# EAGLE design design (EAGLE 9.0.0)
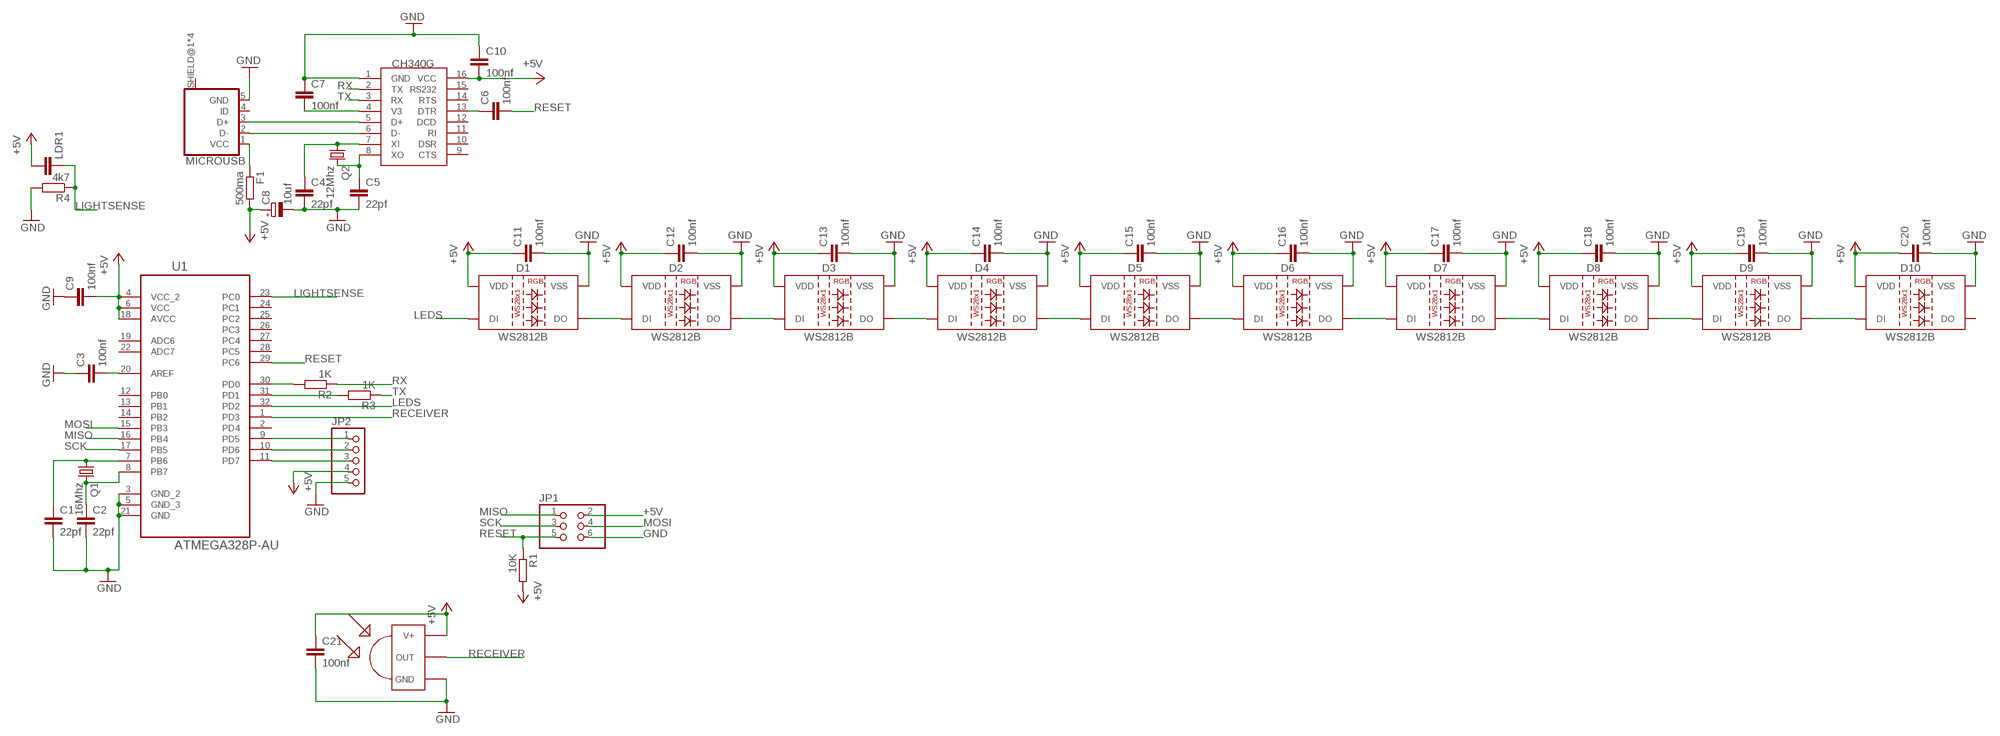
[diagram p0: schematic, sheet 1]

## Parts
C1  22pf  C-EUC0603  [C0603]
C2  22pf  C-EUC0603  [C0603]
C3  100nf  C-EUC0603  [C0603]
C4  22pf  C-EUC0603  [C0603]
C5  22pf  C-EUC0603  [C0603]
C6  100nf  C-EUC0603  [C0603]
C7  100nf  C-EUC0603  [C0603]
C8  10uf  CPOL-EUC  [PANASONIC_C]
C9  100nf  C-EUC0603  [C0603]
C10  100nf  C-EUC0603  [C0603]
C11  100nf  C-EUC0603  [C0603]
C12  100nf  C-EUC0603  [C0603]
C13  100nf  C-EUC0603  [C0603]
C14  100nf  C-EUC0603  [C0603]
C15  100nf  C-EUC0603  [C0603]
C16  100nf  C-EUC0603  [C0603]
C17  100nf  C-EUC0603  [C0603]
C18  100nf  C-EUC0603  [C0603]
C19  100nf  C-EUC0603  [C0603]
C20  100nf  C-EUC0603  [C0603]
C21  100nf  C-EUC0603  [C0603]
D1  WS2812B  [WS2812B]
D2  WS2812B  [WS2812B]
D3  WS2812B  [WS2812B]
D4  WS2812B  [WS2812B]
D5  WS2812B  [WS2812B]
D6  WS2812B  [WS2812B]
D7  WS2812B  [WS2812B]
D8  WS2812B  [WS2812B]
D9  WS2812B  [WS2812B]
D10  WS2812B  [WS2812B]
F1  500ma  R-EU_R1206  [R1206]
JP1  PINHD-2X3  [2X03]
JP2  PINHD-1X5  [1X05]
LDR1  C-EU025-030X050  [C025-030X050]
MICROUSB  MICROUSB  [MICROSUSB]
Q1  16Mhz  CRYSTALHC49S  [HC49/S]
Q2  12Mhz  CRYSTALHC49S  [HC49/S]
R1  10K  R-EU_R0603  [R0603]
R2  1K  R-EU_R0603  [R0603]
R3  1K  R-EU_R0603  [R0603]
R4  4k7  R-EU_R0603  [R0603]
U1  ATMEGA328P-AU  [QFP80P900X900X120-32N]
U2  CH340G  [SOIC16]
U$3  TSOP1838  [TSOP18XX]

## Nets
+5V: C8.+ C9.2 C10.2 C11.1 C12.1 C13.1 C14.1 C15.1 C16.1 C17.1 C18.1 C19.1 C20.1 C21.1 D1.1(VDD) D2.1(VDD) D3.1(VDD) D4.1(VDD) D5.1(VDD) D6.1(VDD) D7.1(VDD) D8.1(VDD) D9.1(VDD) D10.1(VDD) F1.2 JP1.2 JP2.4 LDR1.2 R1.2 U1.4(VCC_2) U1.6(VCC) U1.18(AVCC) U2.16(VCC) U$3.VCC(V+)
D+: MICROUSB.3(D+) U2.5(D+)
D-: MICROUSB.2(D-) U2.6(D-)
GND: C1.2 C2.2 C3.1 C4.2 C5.2 C7.1 C8.- C9.1 C10.1 C11.2 C12.2 C13.2 C14.2 C15.2 C16.2 C17.2 C18.2 C19.2 C20.2 C21.2 D1.3(VSS) D2.3(VSS) D3.3(VSS) D4.3(VSS) D5.3(VSS) D6.3(VSS) D7.3(VSS) D8.3(VSS) D9.3(VSS) D10.3(VSS) JP1.6 JP2.5 MICROUSB.5(GND) R4.2 U1.3(GND_2) U1.5(GND_3) U1.21(GND) U2.1(GND) U$3.GND
LEDS: D1.4(DI) U1.32(PD2)
LIGHTSENSE: LDR1.1 R4.1 U1.23(PC0)
MISO: JP1.1 U1.16(PB4)
MOSI: JP1.4 U1.15(PB3)
N$1: C2.1 Q1.2 U1.8(PB7)
N$2: C1.1 Q1.1 U1.7(PB6)
N$3: C3.2 U1.20(AREF)
N$4: R2.2 U1.30(PD0)
N$5: JP2.1 U1.9(PD5)
N$6: R3.2 U1.31(PD1)
N$7: JP2.2 U1.10(PD6)
N$8: C4.1 Q2.1 U2.7(XI)
N$9: C5.1 Q2.2 U2.8(XO)
N$10: C6.1 U2.13(DTR)
N$11: C7.2 U2.4(V3)
N$12: F1.1 MICROUSB.1(VCC)
N$13: JP2.3 U1.11(PD7)
N$16: D3.2(DO) D4.4(DI)
N$17: D4.2(DO) D5.4(DI)
N$18: D5.2(DO) D6.4(DI)
N$19: D6.2(DO) D7.4(DI)
N$20: D7.2(DO) D8.4(DI)
N$21: D8.2(DO) D9.4(DI)
N$23: D1.2(DO) D2.4(DI)
N$24: D2.2(DO) D3.4(DI)
N$26: D9.2(DO) D10.4(DI)
RECEIVER: U1.1(PD3) U$3.OUT
RESET: C6.2 JP1.5 R1.1 U1.29(PC6)
RX: R2.1 U2.2(TX)
SCK: JP1.3 U1.17(PB5)
TX: R3.1 U2.3(RX)
Unconnected: D10.2(DO) MICROUSB.4(ID) U1.2(PD4) U1.12(PB0) U1.13(PB1) U1.14(PB2) U1.19(ADC6) U1.22(ADC7) U1.24(PC1) U1.25(PC2) U1.26(PC3) U1.27(PC4) U1.28(PC5) U2.9(CTS) U2.10(DSR) U2.11(RI) U2.12(DCD) U2.14(RTS) U2.15(RS232)

## Power pins joined to a net without a drawn wire
SHIELD: MICROUSB.SHIELD@1(SHIELD) MICROUSB.SHIELD@2(SHIELD) MICROUSB.SHIELD@3(SHIELD) MICROUSB.SHIELD@4(SHIELD)

## Library data of the parts
C1-C7 C9-C21 LDR1 = rcl:C-EU: CAPACITOR, European symbol; SPICEPREFIX: C
C8 = rcl:CPOL-EU: POLARIZED CAPACITOR, European symbol; SPICEPREFIX: C
D1-D10 = SparkFun-LED:WS2812B: WS2812B SMD addressable RGB LED 5x5mm SMD LED with built-in controller IC. Color: Red/Green/Blue mC Rating: RGB: 390, 660, 180 mcd Forward Voltage: RGB: 2.0, 3.0, 3.0 V Packages:WS2812B SparkFun Products: Blynk Board - ESP8266 <https://www.sparkfun.com/products/13794>; PROD_ID: DIO-12503
F1 R1-R4 = rcl:R-EU_: RESISTOR, European symbol; SPICEPREFIX: R
JP1 = pinhead:PINHD-2X3: PIN HEADER
JP2 = pinhead:PINHD-1X5: PIN HEADER
MICROUSB = microusb-fried:MICROUSB
Q1 Q2 = crystal:CRYSTAL: CRYSTAL; OC_FARNELL: 1667008; OC_NEWARK: unknown
U1 = Atmel_By_element14_Batch_1-00:ATMEGA328P-AU: 8-bit Microcontroller with In-System Programmable Flash; MPN: ATMEGA328P-AU; OC_FARNELL: 1715486; OC_NEWARK: 14R4631; PACKAGE: TQFP-32; SUPPLIER: Atmel
U2 = ch340g:CH340G
U$3 = tsop:TSOP1838: IR Receiver and Demodulator

## Board
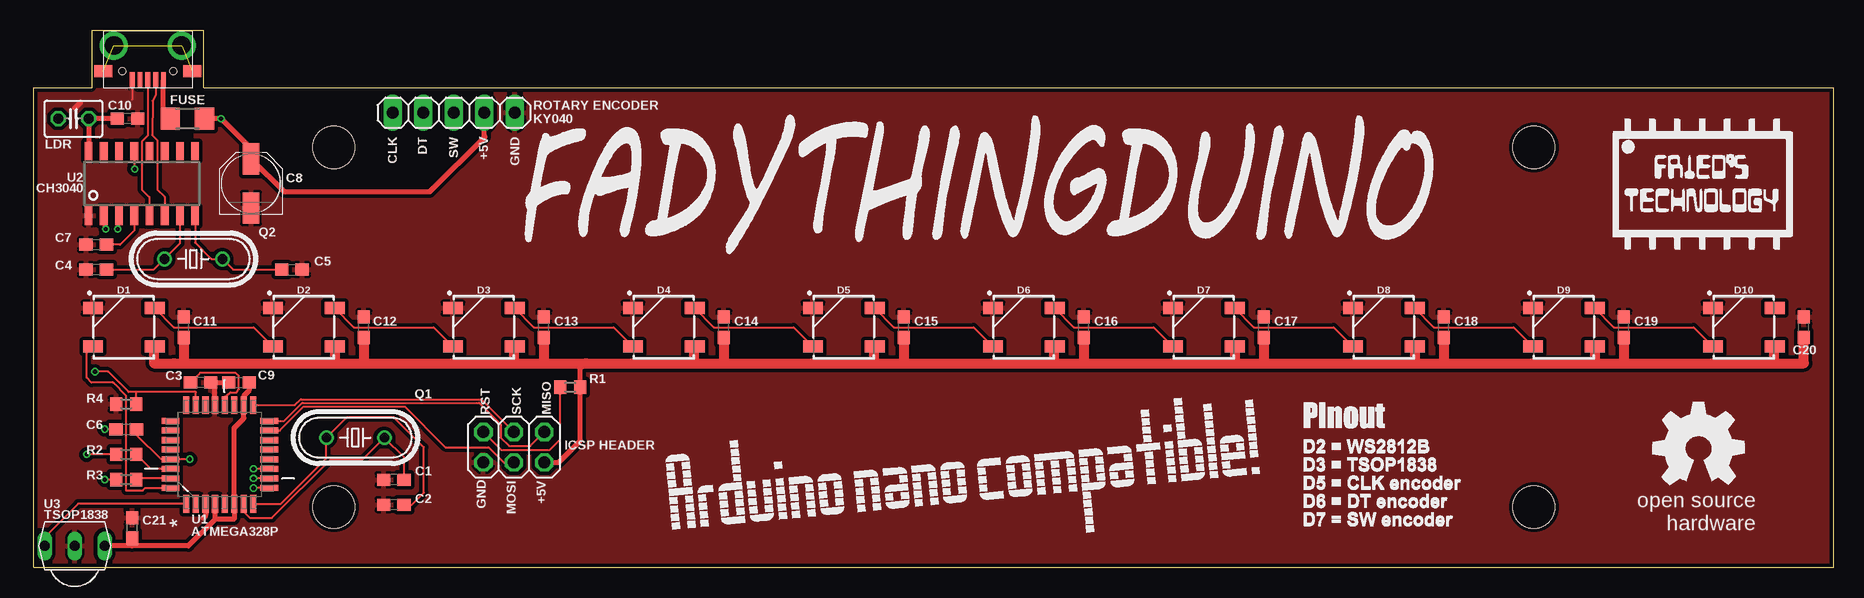
[diagram p1: board, top side]
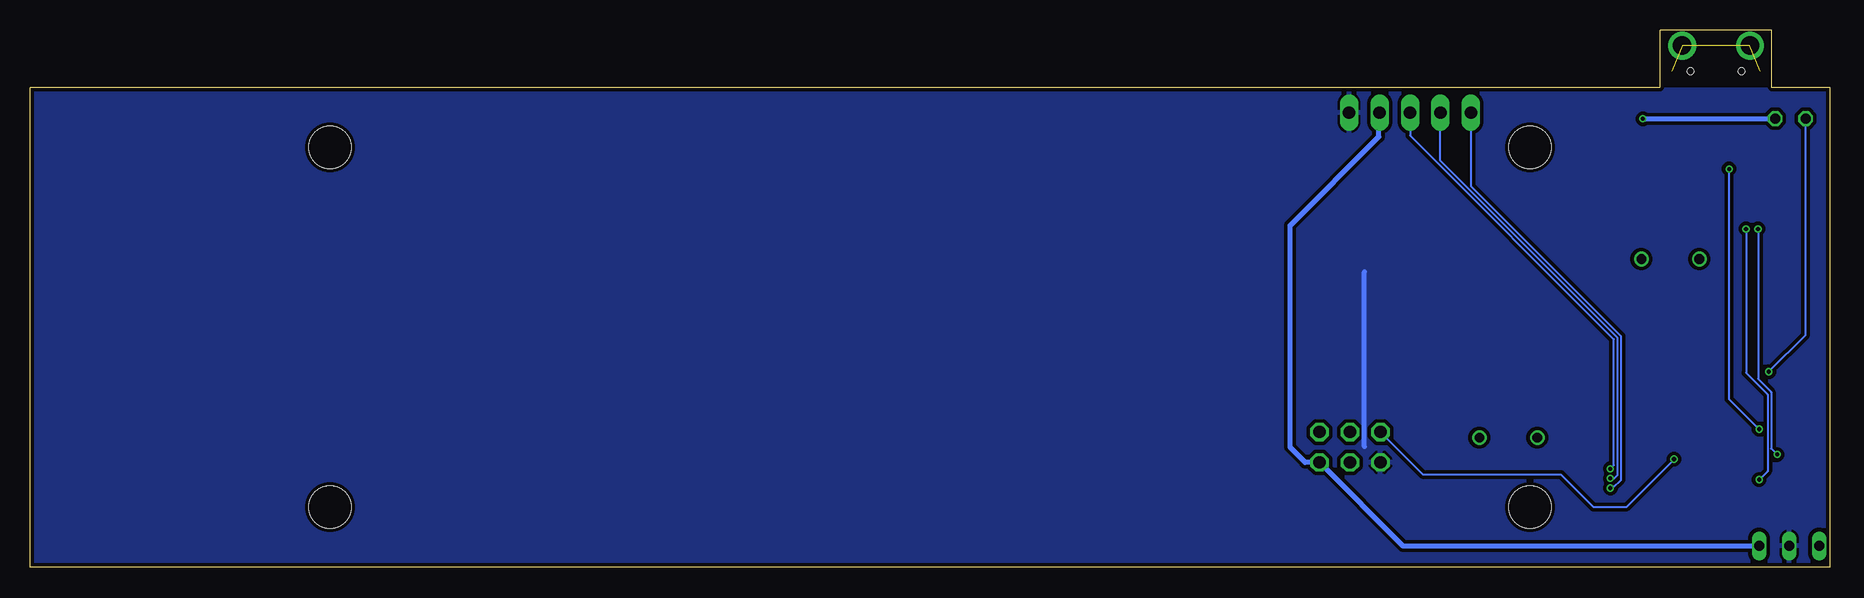
[diagram p2: board, bottom side, seen from below]

Size 150 x 44.8 mm. Coordinates in mm from the lower left corner, seen from the top.
Outline: 0,0 150,0 150,40 14.15,40 14.15,44.8 4.85,44.8 4.85,40 0,40 0,0
Copper layers (1*16): Top 0.018mm / dielectric 1.55mm / Bottom 0.018mm
Design rules "eC_2Layer_PClass6_BaseCopperO18_eCDefault": minimum track width 0.15mm, minimum drill 0.35mm, track to track 0.15mm, track to pad 0.15mm, pad to pad 0.15mm, via to via 0.15mm, smd to smd 0mil, copper to edge 0.25mm, drill to drill 0.35mm, minimum pad ring 0.175mm, minimum via ring 0.125mm, stop-mask expansion 0mil, vias tented up to drill 0.45mm, thermal gap 0.2mm
Holes 3.5 mm at 125,35 125,5 25,35 25,5

### Footprints (pad centres in the part's own frame; a part is rotated, then mirrored left to right if it is on the bottom)
C0603 = smd 1.1 x 1: 1 -0.85,0; 2 0.85,0
PANASONIC_C = smd 2.6 x 1.4: + 2.05,0; - -2.05,0
WS2812B = smd 1.651 x 1: 1 2.577,-1.6; 2 2.577,1.6; 3 -2.577,1.6; 4 -2.577,-1.6
R1206 = smd 1.6 x 1.803: 1 -1.422,0; 2 1.422,0
2X03 = drill 1.016 octagon: 1 -2.54,-1.27; 2 -2.54,1.27; 3 0,-1.27; 4 0,1.27; 5 2.54,-1.27; 6 2.54,1.27
1X05 = drill 1.016 long: 1 -5.08,0; 2 -2.54,0; 3 0,0; 4 2.54,0; 5 5.08,0
C025-030X050 = drill 0.813 octagon: 1 -1.27,0; 2 1.27,0
MICROSUSB = smd 0.4 x 1.35: 1 -1.3,1.73; 2 -0.65,1.73; 3 0,1.73; 4 0.65,1.73; 5 1.3,1.73 | smd 1.5 x 1: SHIELD@1 -3.7,1; SHIELD@2 3.7,1 | drill 1.55 pad 2.1: SHIELD@3 -2.82,-1.15; SHIELD@4 2.83,-1.15 | hole 0.55: -2.12,1; 2.13,1
HC49/S = drill 0.813: 1 -2.413,0; 2 2.413,0
R0603 = smd 1 x 1.1: 1 -0.85,0; 2 0.85,0
QFP80P900X900X120-32N = smd 1.473 x 0.508: 1 -4.115,2.794; 2 -4.115,2.007; 3 -4.115,1.194; 4 -4.115,0.406; 5 -4.115,-0.406; 6 -4.115,-1.194; 7 -4.115,-2.007; 8 -4.115,-2.794; 17 4.115,-2.794; 18 4.115,-2.007; 19 4.115,-1.194; 20 4.115,-0.406; 21 4.115,0.406; 22 4.115,1.194; 23 4.115,2.007; 24 4.115,2.794 | smd 0.508 x 1.473: 9 -2.794,-4.115; 10 -2.007,-4.115; 11 -1.194,-4.115; 12 -0.406,-4.115; 13 0.406,-4.115; 14 1.194,-4.115; 15 2.007,-4.115; 16 2.794,-4.115; 25 2.794,4.115; 26 2.007,4.115; 27 1.194,4.115; 28 0.406,4.115; 29 -0.406,4.115; 30 -1.194,4.115; 31 -2.007,4.115; 32 -2.794,4.115
SOIC16 = smd 0.635 x 1.524: 1 -4.445,-2.695; 2 -3.175,-2.695; 3 -1.905,-2.695; 4 -0.635,-2.695; 5 0.635,-2.695; 6 1.905,-2.695; 7 3.175,-2.695; 8 4.445,-2.695; 9 4.445,2.695; 10 3.175,2.695; 11 1.905,2.695; 12 0.635,2.695; 13 -0.635,2.695; 14 -1.905,2.695; 15 -3.175,2.695; 16 -4.445,2.695
TSOP18XX = drill 0.813 long: GND -0.001,-0.027; OUT -2.501,-0.027; VCC 2.499,-0.027

### Placement (x,y rotation side)
C1  30,7.3 180 top
C2  30,5.2 180 top
C3  13.9,15.4 180 top
C4  5.2,24.8 180 top
C5  21.5,24.8 0 top
C6  7.7,11.5 0 top
C7  5.2,26.9 0 top
C8  18.1,32 90 top
C9  17.1,15.4 0 top
C10  7.8,37.4 180 top
C11  12.5,20 90 top
C12  27.5,20 90 top
C13  42.5,20 90 top
C14  57.5,20 90 top
C15  72.5,20 90 top
C16  87.5,20 90 top
C17  102.5,20 90 top
C18  117.5,20 90 top
C19  132.5,20 90 top
C20  147.5,20 90 top
C21  8.2,3.27 90 top
D1  7.5,20 0 top
D2  22.5,20 0 top
D3  37.5,20 0 top
D4  52.5,20 0 top
D5  67.5,20 0 top
D6  82.5,20 0 top
D7  97.5,20 0 top
D8  112.5,20 0 top
D9  127.5,20 0 top
D10  142.5,20 0 top
F1  12.8,37.4 0 top
JP1  40,10 180 top
JP2  35,37.9 0 top
LDR1  3.3,37.4 0 top
MICROUSB  9.5,42.35 180 top
Q1  26.8,10.8 180 top
Q2  13.3,25.7 0 top
R1  44.7,15 0 top
R2  7.7,9.4 0 top
R3  7.7,7.3 0 top
R4  7.7,13.6 180 top
U1  15.5,9.4 90 top
U2  9,32 0 top
U$1  [OSHW_8MM]  138.7,9.9 0 top
U$3  3.4,1.8 0 top

### Tracks (layer width: path | path; a pad name or v marks a point on that pad's centre or on a via)
+5V  (via drill 0.35)
  Top 0.405: v15.6,37.4 F1.2 | 37.6,35.9 37.54,35.96 JP2.4
  Top 0.406: 11.65,16.95 11.7,17 | 15.1,4 16.69,4 U1.6 16.69,11.59 17.51,12.41 U1.18 17.5,13.52 17.5,14.3 17.95,14.75 C9.2 | 15.1,4 U1.4 | 15.1,4 12.87,1.77 8.2,1.77 | 8.2,1.77 U$3.VCC | C21.1 8.2,1.77 | JP1.2 43.73,8.73 45.55,10.55 R1.2 45.55,16.55 46,17 | C10.2 LDR1.2 4.57,34.71 U2.16 | 37.6,35.9 33,31.3 20.85,31.3 C8.+ 18.1,34.9 v15.6,37.4
  Top 0.813: D1.1 10,18.32 10,17 11.7,17 12.5,17 | C20.1 147.5,17 145,17 | 12.5,17 25.08,17 | 25.08,17 27.5,17 | 27.5,17 40,17 | 40,17 42.5,17 | 42.5,17 46,17 55,17 | 55,17 57.5,17 | 57.5,17 70,17 | 70,17 72.5,17 | 72.5,17 85,17 | 85,17 87.5,17 | 87.5,17 100.08,17 | 100.08,17 102.5,17 | 102.5,17 115.08,17 | 115.08,17 117.5,17 | 117.5,17 130.08,17 | 130.08,17 132.5,17 | 132.5,17 145,17 | D10.1 145,18.4 145,17 | C19.1 132.5,17 | D9.1 130.08,17 | D8.1 115.08,17 | D7.1 100.08,17 | C18.1 117.5,17 | C17.1 102.5,17 | C16.1 87.5,17 | D6.1 85,18.4 85,17 | C15.1 72.5,17 | D5.1 70,18.4 70,17 | C14.1 57.5,17 | D4.1 55,18.4 55,17 | C13.1 42.5,17 | D3.1 40,18.4 40,17 | C12.1 27.5,17 | D2.1 25.08,17 | C11.1 12.5,17
  Bottom 0.405: 45,20.9 45,28.5 37.6,35.9 37.6,36.84 JP2.4
  Bottom 0.406: 45,20.9 45,10 43.73,8.73 JP1.2 35.58,1.77 U$3.VCC | v15.6,37.4 LDR1.2
D+
  Top 0.152: MICROUSB.3 9.5,36 9,35.5 9,31.5 9.63,30.86 U2.5
D-
  Top 0.152: MICROUSB.2 10.15,39.35 9.9,38.9 9.85,36.05 10.3,35.6 10.3,31.5 10.9,30.89 U2.6
GND
  Top 0.152: 4.62,27.12 C7.1 | MICROUSB.5 8.2,39
  Top 0.406: 3.9,38.8 3.4,38.3 | 4.55,27.2 4.62,27.12 | U1.3 14.31,4.31 14.1,4.1 | 8.22,4.1 C21.2 | 15.09,15.4 C3.1 15.09,15.06 | 15.09,15.4 C9.1 | U1.21 15.09,15.4
  Bottom 0.406: 38.8,10.07 38.8,24.61
  pour Top (isolate 0.305): 0,0 0,39.8 12,39.8 11.9,35.2 13.5,35.2 13.6,39.8 149.8,39.8 149.8,0.2 148.6,0.2 148.6,0
  pour Bottom (isolate 0.305): 0,0.2 0,39.8 149.8,39.8 149.8,0.2
LEDS
  Top 0.152: 4.9,18.38 D1.4 4.4,17.88 4.4,15.8 4.8,15.4 6.6,15.4 7.7,14.3 7.7,6.4 9.08,6.4 9.29,6.61 U1.32
LIGHTSENSE  (via drill 0.35)
  Top 0.152: U1.23 13.5,13.52 13.5,14.6 8.5,14.6 | v5.1,16.3 6.2,16.3 7.9,14.6 8.5,14.6 | R4.1 8.55,14.55 8.5,14.6
  Bottom 0.152: v5.1,16.3 2.03,19.37 LDR1.1
MISO
  Top 0.152: U1.16 20.87,12.19 22.38,13.7 37.1,13.7 38.9,11.9 38.9,10.8 39.6,10.1 41.37,10.1 JP1.1
MOSI
  Top 0.152: U1.15 20.5,11.4 22.5,13.4 30.9,13.4 34.3,10 37.9,10 39.2,8.7 39.97,8.7 JP1.4 39.97,8.73
N$1
  Top 0.152: 18.38,5.2 U1.8 20.59,5.29 24.4,9.1 24.39,9.11 Q1.2 26.09,12.5 30,12.5 32.5,10 32.5,6.2 31.5,5.2 C2.1
N$2
  Top 0.152: U1.7 17.51,4.59 18,4.1 19.83,4.1 24.73,9 27.41,9 Q1.1 30.85,9.16 C1.1
N$3
  Top 0.152: U1.20 15.91,14.21 16.37,14.57 16.89,14.57 17.08,14.86 17.08,15.94 16.82,16.2 13.85,16.2 C3.2
N$4
  Top 0.152: U1.30 9.74,8.21 R2.2
N$5  (via drill 0.35)
  Top 0.152: U1.9 v18.3,6.6
  Bottom 0.152: v18.3,6.6 18.1,6.6 17.4,7.3 17.4,19.25 29.92,31.77 JP2.1
N$6
  Top 0.152: U1.31 8.64,7.39 R3.2
N$7  (via drill 0.35)
  Top 0.152: U1.10 v18.3,7.4
  Bottom 0.152: v18.3,7.4 18,7.4 17.7,7.7 17.7,19.13 32.46,33.89 JP2.2
N$8
  Top 0.152: C4.1 9.99,24.8 Q2.1 12.18,26.99 U2.7
N$9
  Top 0.152: U2.8 13.45,27.05 14.8,25.7 Q2.2 16.61,24.8 C5.1
N$10  (via drill 0.35)
  Top 0.152: C6.1 v5.9,11.5 | v8.4,33.2 8.4,34.66 U2.13
  Bottom 0.152: v5.9,11.5 8.4,14 v8.4,33.2
N$11
  Top 0.152: 8.37,28.71 U2.4 8.37,28.07 7.2,26.9 C7.2
N$12
  Top 0.405: F1.1 10.8,37.4
  Top 0.406: 10.8,37.4 MICROUSB.1
N$13  (via drill 0.35)
  Top 0.152: U1.11 v18.31,8.21 v18.3,8.2
  Bottom 0.152: v18.3,8.2 18,8.49 18,19 35,36 JP2.3
N$16
  Top 0.152: D3.2 41.68,20 48.32,20 D4.4
N$17
  Top 0.152: D4.2 56.68,20 63.32,20 D5.4
N$18
  Top 0.152: D5.2 71.68,20 78.32,20 D6.4
N$19
  Top 0.152: D6.2 86.68,20 93.32,20 D7.4
N$20
  Top 0.152: D7.2 101.68,20 108.32,20 D8.4
N$21
  Top 0.152: D8.2 116.68,20 123.32,20 D9.4
N$23
  Top 0.152: D1.2 11.68,20 18.32,20 D2.4
N$24
  Top 0.152: D2.2 26.68,20 33.32,20 D3.4
N$26
  Top 0.152: D9.2 131.68,20 138.32,20 D10.4
RECEIVER
  Top 0.152: U$3.OUT 0.9,2.5 3.69,5.29 U1.1
RESET  (via drill 0.35)
  Top 0.152: C6.2 8.55,11.05 10.61,8.99 U1.29 v12.99,8.99 v13,9 | JP1.5 38.93,9.8 43,9.8 43.85,10.65 R1.1
  Bottom 0.152: JP1.5 33.89,7.7 22.4,7.7 19.7,5 17,5 v13,9
RX  (via drill 0.35)
  Top 0.152: v6,28.2 5.83,28.38 U2.2 | R2.1 v4.4,9.4
  Bottom 0.152: v6,28.2 6,15.7 4.9,14.6 4.9,9.9 v4.4,9.4
SCK
  Top 0.152: U1.17 21.76,13.52 22.25,14.01 37.27,14.01 JP1.3
SHIELD  (3 unrouted)
TX  (via drill 0.35)
  Top 0.152: v7,28.2 7.1,28.3 7.1,28.7 7.09,28.7 U2.3 | R3.1 v5.9,7.3
  Bottom 0.152: v5.9,7.3 5.2,8 5.2,14.4 7,16.2 v7,28.2

### Text on the board
tNames: FUSE | ROTARY ENCODER / KY040 | CLK | DT | SW | +5V | GND | LDR | U2 | CH3040 | RST | SCK | MISO | ICSP HEADER | GND | MOSI | +5V | U3 | TSOP1838 | ATMEGA328P